# EAGLE design porcupine5v1_3 (EAGLE 6.5.0)
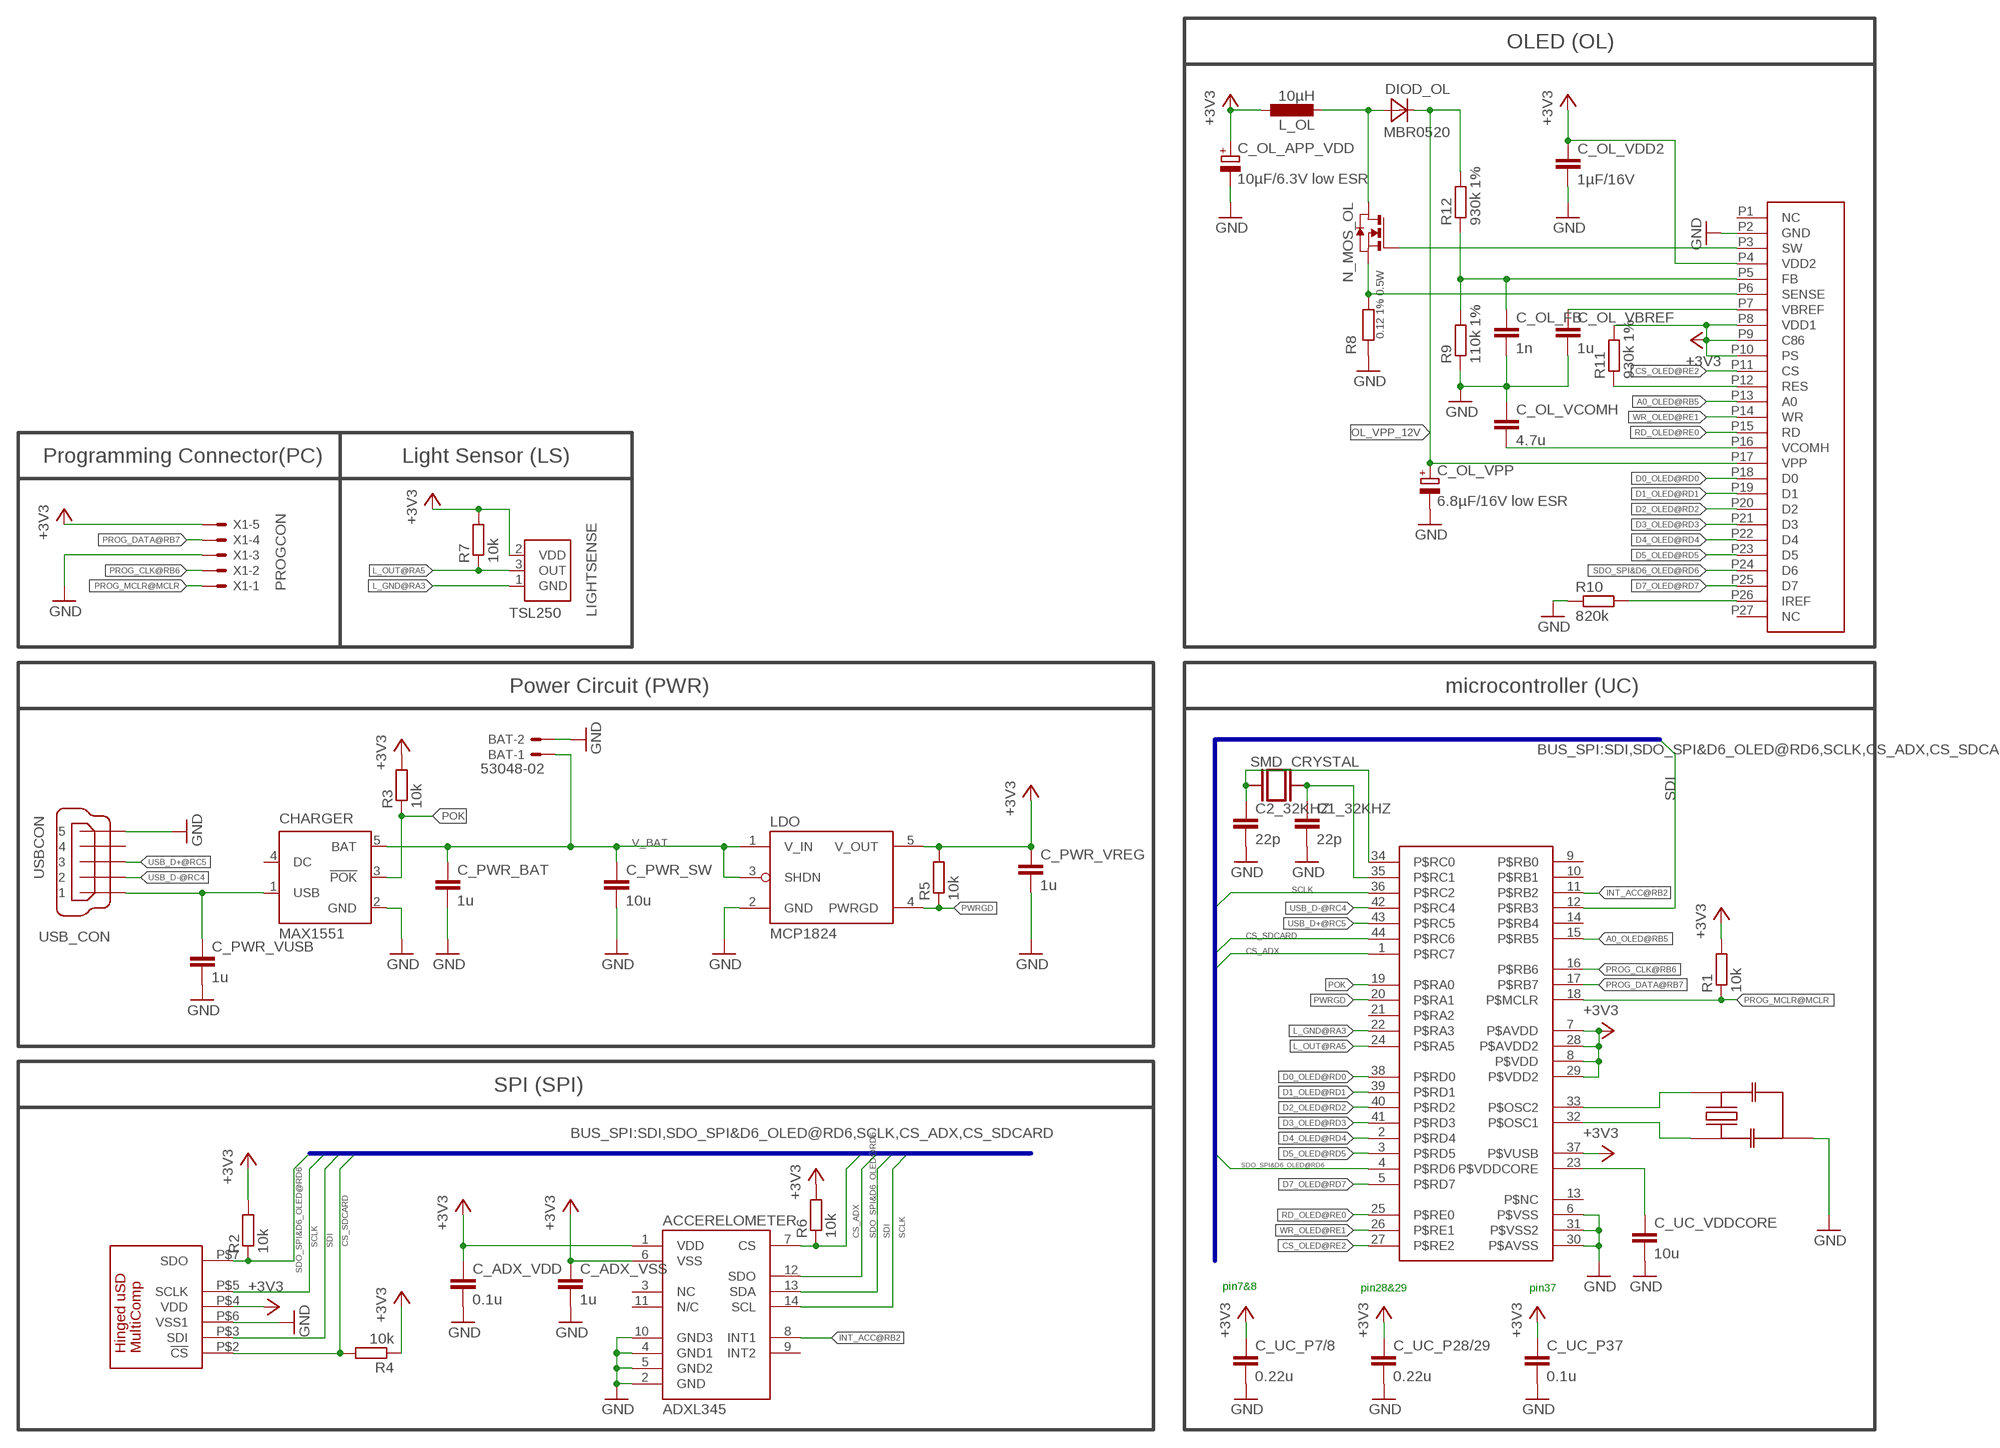
[diagram p0: schematic, sheet 1]

## Parts
ACCERELOMETER  ADXL345  [LGA14]
BAT  53048-02  [53048-02]
C1_32KHZ  22p  C-EUC0603K  [C0603K]
C2_32KHZ  22p  C-EUC0603K  [C0603K]
C_ADX_VDD  0.1u  C-EUC0603K  [C0603K]
C_ADX_VSS  1u  C-EUC0603K  [C0603K]
C_OL_APP_VDD  10µF/6.3V low ESR  CPOL-EUA/3216-18R  [A/3216-18R]
C_OL_FB  1n  C-EUC0603K  [C0603K]
C_OL_VBREF  1u  C-EUC0603K  [C0603K]
C_OL_VCOMH  4.7u  C-EUC0603K  [C0603K]
C_OL_VDD2  1µF/16V  C-EUC0603K  [C0603K]
C_OL_VPP  6.8µF/16V low ESR  CPOL-EUA/3216-18R  [A/3216-18R]
C_PWR_BAT  1u  C-EUC0603K  [C0603K]
C_PWR_SW  10u  C-EUC0805K  [C0805K]
C_PWR_VREG  1u  C-EUC0603K  [C0603K]
C_PWR_VUSB  1u  C-EUC0603K  [C0603K]
C_UC_P7/8  0.22u  C-EUC0603K  [C0603K]
C_UC_P28/29  0.22u  C-EUC0603K  [C0603K]
C_UC_P37  0.1u  C-EUC0603K  [C0603K]
C_UC_VDDCORE  10u  C-EUC0805K  [C0805K]
CHARGER  MAX1551  [SOT23-5L]
CON_OLED  OLED_DENSITRON  [CON_DD-12864WE-1A]
DIOD_OL  MBR0520  [SOD123]
L_OL  10µH  LQH3NP  [1212_FOR_INDUCTANCE]
LDO  MCP1824  [SOT-23-5]
LIGHTSENSE  TSL250  [TSL]
N_MOS_OL  MGSF1N02LT1  [SOT-23]
PIC_CONTROLLER  PIC_P2V6  [QFN44ML8X8]
R1  10k  R-EU_R0603  [R0603]
R2  10k  R-EU_R0603  [R0603]
R3  10k  R-EU_R0603  [R0603]
R4  10k  R-EU_R0603  [R0603]
R5  10k  R-EU_R0603  [R0603]
R6  10k  R-EU_R0603  [R0603]
R7  10k  R-EU_R0603  [R0603]
R8  0.12 1% 0.5W  RESISTOR_PAN_ERJB3CFR12V  [0805_UPSIDEDOWN]
R9  110k 1%  R-EU_R0603  [R0603]
R10  820k  R-EU_R0603  [R0603]
R11  930k 1%  R-EU_R0603  [R0603]
R12  930k 1%  R-EU_R0603  [R0603]
RESONATOR  RESONATORPRQC-S  [PRQC]
SDCARD_CON  MICROSD_CONN  [460DA40013]
SMD_CRYSTAL  SMD_CRYSTAL  [SMD_CRYSTAL]
USB_CON  USBCON  [248601]
X1  PROGCON  [53047-05-OCT]

## Nets
+3V3: ACCERELOMETER.1(VDD) ACCERELOMETER.6(VSS) C_ADX_VDD.1 C_ADX_VSS.1 C_OL_APP_VDD.+ C_OL_VDD2.2 C_PWR_VREG.1 C_UC_P7/8.1 C_UC_P28/29.1 C_UC_P37.1 CON_OLED.P4(VDD2) CON_OLED.P8(VDD1) CON_OLED.P9(C86) CON_OLED.P10(PS) L_OL.P$1 LDO.5(V_OUT) LIGHTSENSE.2(VDD) PIC_CONTROLLER.7(P$AVDD) PIC_CONTROLLER.8(P$VDD) PIC_CONTROLLER.28(P$AVDD2) PIC_CONTROLLER.29(P$VDD2) PIC_CONTROLLER.37(P$VUSB) R1.2 R2.2 R3.2 R4.1 R5.2 R6.2 R7.2 R11.2 SDCARD_CON.P$4(VDD) X1.5
A0_OLED@RB5: CON_OLED.P13(A0) PIC_CONTROLLER.15(P$RB5)
CS_ADX: ACCERELOMETER.7(CS) PIC_CONTROLLER.1(P$RC7) R6.1
CS_OLED@RE2: CON_OLED.P11(CS) PIC_CONTROLLER.27(P$RE2)
CS_SDCARD: PIC_CONTROLLER.44(P$RC6) R4.2 SDCARD_CON.P$2(!CS)
D0_OLED@RD0: CON_OLED.P18(D0) PIC_CONTROLLER.38(P$RD0)
D1_OLED@RD1: CON_OLED.P19(D1) PIC_CONTROLLER.39(P$RD1)
D2_OLED@RD2: CON_OLED.P20(D2) PIC_CONTROLLER.40(P$RD2)
D3_OLED@RD3: CON_OLED.P21(D3) PIC_CONTROLLER.41(P$RD3)
D4_OLED@RD4: CON_OLED.P22(D4) PIC_CONTROLLER.2(P$RD4)
D5_OLED@RD5: CON_OLED.P23(D5) PIC_CONTROLLER.3(P$RD5)
D7_OLED@RD7: CON_OLED.P25(D7) PIC_CONTROLLER.5(P$RD7)
GND: ACCERELOMETER.2(GND) ACCERELOMETER.4(GND1) ACCERELOMETER.5(GND2) ACCERELOMETER.10(GND3) BAT.2 C1_32KHZ.2 C2_32KHZ.2 C_ADX_VDD.2 C_ADX_VSS.2 C_OL_APP_VDD.- C_OL_FB.2 C_OL_VBREF.2 C_OL_VCOMH.1 C_OL_VDD2.1 C_OL_VPP.- C_PWR_BAT.2 C_PWR_SW.2 C_PWR_VREG.2 C_PWR_VUSB.2 C_UC_P7/8.2 C_UC_P28/29.2 C_UC_P37.2 C_UC_VDDCORE.2 CHARGER.2(GND) CON_OLED.P2(GND) LDO.2(GND) PIC_CONTROLLER.6(P$VSS) PIC_CONTROLLER.30(P$AVSS) PIC_CONTROLLER.31(P$VSS2) R8.P$2 R9.1 R10.1 RESONATOR.GND SDCARD_CON.P$6(VSS1) USB_CON.5 X1.3
INT_ACC@RB2: ACCERELOMETER.8(INT1) PIC_CONTROLLER.11(P$RB2)
L_GND@RA3: LIGHTSENSE.1(GND) PIC_CONTROLLER.22(P$RA3)
L_OUT@RA5: LIGHTSENSE.3(OUT) PIC_CONTROLLER.24(P$RA5) R7.1
N$1: PIC_CONTROLLER.33(P$OSC2) RESONATOR.1
N$2: PIC_CONTROLLER.32(P$OSC1) RESONATOR.2
N$3: C2_32KHZ.1 PIC_CONTROLLER.34(P$RC0) SMD_CRYSTAL.P$1
N$6: C1_32KHZ.1 PIC_CONTROLLER.35(P$RC1) SMD_CRYSTAL.P$2
N$10: DIOD_OL.A L_OL.P$2 N_MOS_OL.1(D)
OL_FB: C_OL_FB.1 CON_OLED.P5(FB) R9.2 R12.1
OL_IREF: CON_OLED.P26(IREF) R10.2
OL_SENSE: CON_OLED.P6(SENSE) N_MOS_OL.2(S) R8.P$3
OL_SW: CON_OLED.P3(SW) N_MOS_OL.3(G)
OL_VBREF: C_OL_VBREF.1 CON_OLED.P7(VBREF)
OL_VCOMH: C_OL_VCOMH.2 CON_OLED.P16(VCOMH)
OL_VPP_12V: C_OL_VPP.+ CON_OLED.P17(VPP) DIOD_OL.C R12.2
POK: CHARGER.3(!POK) PIC_CONTROLLER.19(P$RA0) R3.1
PROG_CLK@RB6: PIC_CONTROLLER.16(P$RB6) X1.2
PROG_DATA@RB7: PIC_CONTROLLER.17(P$RB7) X1.4
PROG_MCLR@MCLR: PIC_CONTROLLER.18(P$MCLR) R1.1 X1.1
PWRGD: LDO.4(PWRGD) PIC_CONTROLLER.20(P$RA1) R5.1
RD_OLED@RE0: CON_OLED.P15(RD) PIC_CONTROLLER.25(P$RE0)
RES_OLED: CON_OLED.P12(RES) R11.1
SCLK: ACCERELOMETER.14(SCL) PIC_CONTROLLER.36(P$RC2) SDCARD_CON.P$5(SCLK)
SDI: ACCERELOMETER.13(SDA) PIC_CONTROLLER.12(P$RB3) SDCARD_CON.P$3(SDI)
SDO_SPI&D6_OLED@RD6: ACCERELOMETER.12(SDO) CON_OLED.P24(D6) PIC_CONTROLLER.4(P$RD6) R2.1 SDCARD_CON.P$7(SDO)
USB_D+@RC5: PIC_CONTROLLER.43(P$RC5) USB_CON.3
USB_D-@RC4: PIC_CONTROLLER.42(P$RC4) USB_CON.2
V_BAT: BAT.1 C_PWR_BAT.1 C_PWR_SW.1 CHARGER.5(BAT) LDO.1(V_IN) LDO.3(SHDN)
VDDCORE: C_UC_VDDCORE.1 PIC_CONTROLLER.23(P$VDDCORE)
VUSB: C_PWR_VUSB.1 CHARGER.1(USB) USB_CON.1
WR_OLED@RE1: CON_OLED.P14(WR) PIC_CONTROLLER.26(P$RE1)
Unconnected: ACCERELOMETER.3(NC) ACCERELOMETER.9(INT2) ACCERELOMETER.11(N/C) CHARGER.4(DC) CON_OLED.P1(NC) CON_OLED.P27(NC) PIC_CONTROLLER.9(P$RB0) PIC_CONTROLLER.10(P$RB1) PIC_CONTROLLER.13(P$NC) PIC_CONTROLLER.14(P$RB4) PIC_CONTROLLER.21(P$RA2) USB_CON.4

## Buses
BUS_SPI:SDI,SDO_SPI&D6_OLED@RD6,SCLK,CS_ADX,CS_SDCARD

## Notes on the sheet
- OLED (OL)
- Programming Connector(PC) | Light Sensor (LS)
- Power Circuit (PWR) | microcontroller (UC)
- SPI (SPI)
- pin7&8 | pin28&29 | pin37

## Library data of the parts
ACCERELOMETER = HedgehogLib:ADXL345
BAT = con-molex:53?-02: CONNECTOR wire to board 1.25 mm (.049 inch) pitch header; MF: MOLEX; MPN: 53048-0210; OC_FARNELL: 1012259; OC_NEWARK: 57H4718
C1_32KHZ C2_32KHZ C_ADX_VDD C_ADX_VSS C_OL_FB C_OL_VBREF C_OL_VCOMH C_OL_VDD2 C_PWR_BAT C_PWR_SW C_PWR_VREG C_PWR_VUSB C_UC_P7/8 C_UC_P28/29 C_UC_P37 C_UC_VDDCORE = rcl:C-EU: CAPACITOR, European symbol
C_OL_APP_VDD C_OL_VPP = rcl:CPOL-EU: POLARIZED CAPACITOR, European symbol
CHARGER = maxim:MAX1551: Dual-Input USB/AC Adapter 1-Cell Li+ Battery Chargers Source: http://www.maxim-ic.com .. MAX1551-MAX1555.pdf
CON_OLED = HedgehogLib:OLED_DENSITRON
DIOD_OL = HedgehogLib:MBR0520
L_OL = HedgehogLib:LQH3NP
LDO = HedgehogLib:MCP1824: MCP1824T-3302E/OT http://de.farnell.com/1578387
LIGHTSENSE = HedgehogLib:TSL250
N_MOS_OL = HedgehogLib:MGSF1N02LT1: MOS FET
PIC_CONTROLLER = HedgehogLib:PIC_P2V6
R1-R7 R9-R12 = rcl:R-EU_: RESISTOR, European symbol
R8 = HedgehogLib:RESISTOR_PAN_ERJB3CFR12V
RESONATOR = jnode:RESONATOR: Ceramic Resonator with caps AWSCR-16.00CV-T: 16Mhz ceramic resonator with 22pF capacitors PRQC16.00SR5010X000: 16Mhz ceramic resonator with 10pF capacitors; DIGIKEY: http://search.digikey.com/scripts/DkSearch/dksus.dll?Detail&name=478-5420-1-ND
SDCARD_CON = HedgehogLib:MICROSD_CONN
SMD_CRYSTAL = HedgehogLib:SMD_CRYSTAL
USB_CON = HedgehogLib:USBCON: MINI USB 2.0 Connector TypeB
X1 = HedgehogLib:PROGCON: Programmer Connector wire to board 1.25 mm (.049 inch) pitch header

## Board
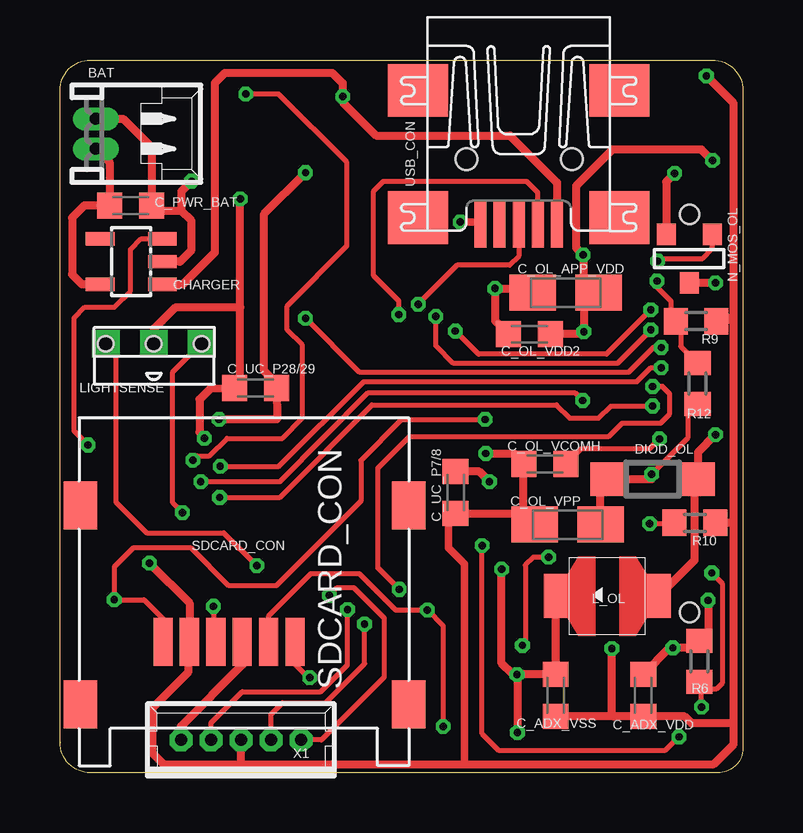
[diagram p1: board, top side]
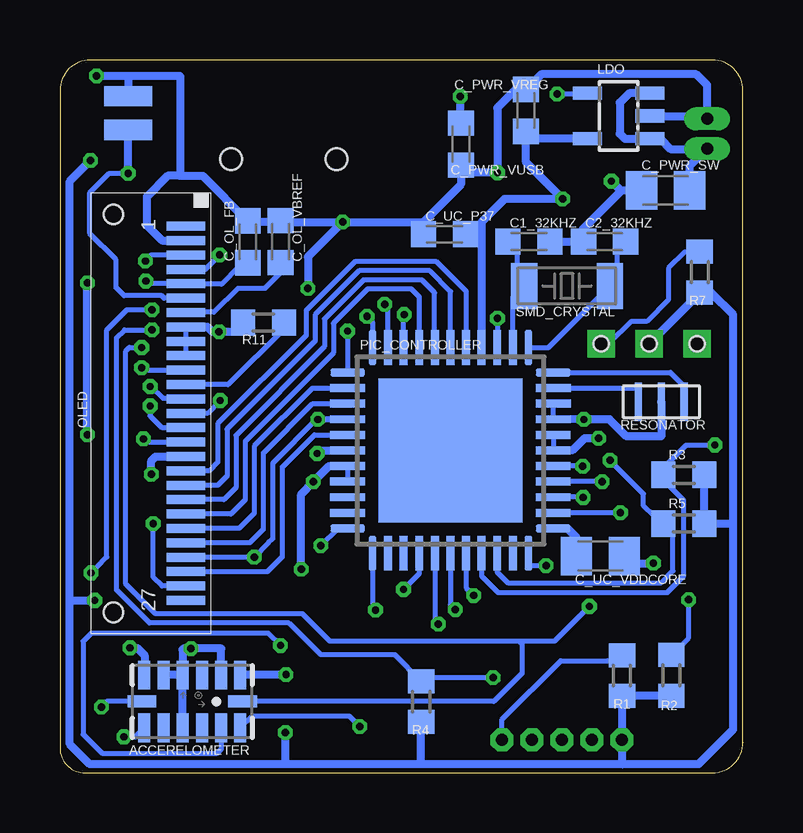
[diagram p2: board, bottom side, seen from below]

Size 28.47 x 29.72 mm. Coordinates in mm from the lower left corner, seen from the top.
Outline: 0,1.27 arc90 1.27,0 27.43,0 arc90 28.47,1.02 28.47,28.45 arc90 27.2,29.72 1.27,29.72 arc90 0,28.45 0,1.27
Outline: 0,1.27 0,1.25
Copper layers (1*16): Top 0.035mm / dielectric 1.5mm / Bottom 0.035mm
Design rules "default *": minimum track width 6mil, minimum drill 12mil, track to track 7mil, track to pad 7mil, pad to pad 7mil, via to via 7mil, smd to smd 7mil, copper to edge 6mil, drill to drill 6mil, minimum pad ring 9mil, minimum via ring 6mil, stop-mask expansion 6mil, vias tented up to drill 0mil, thermal gap 10mil

### Footprints (pad centres in the part's own frame; a part is rotated, then mirrored left to right if it is on the bottom)
LGA14 = smd 0.5 x 1.2: 1 2,1.1; 2 1.2,1.1; 3 0.4,1.1; 4 -0.4,1.1; 5 -1.2,1.1; 6 -2,1.1; 8 -2,-1.1; 9 -1.2,-1.1; 10 -0.4,-1.1; 11 0.4,-1.1; 12 1.2,-1.1; 13 2,-1.1 | smd 1.2 x 0.5: 7 -2.1,0; 14 2.1,0
53048-02 = drill 0.5 pad 0.698 long: 1 0.625,-1.25; 2 -0.625,-1.25
C0603K = smd 1.05 x 1.08: 1 -0.875,0; 2 0.875,0
A/3216-18R = smd 1.95 x 1.5: + 1.375,0; - -1.375,0
C0805K = smd 1.3 x 1.6: 1 -1,0; 2 1,0
SOT23-5L = smd 0.55 x 1.2: 1 -0.95,-1.3; 2 0,-1.3; 3 0.95,-1.3; 4 0.95,1.3; 5 -0.95,1.3
CON_DD-12864WE-1A = smd 0.375 x 1.6: P1 7.8,0; P2 7.2,0; P3 6.6,0; P4 6,0; P5 5.4,0; P6 4.8,0; P7 4.2,0; P8 3.6,0; P9 3,0; P10 2.4,0; P11 1.8,0; P12 1.2,0; P13 0.6,0; P14 0,0; P15 -0.6,0; P16 -1.2,0; P17 -1.8,0; P18 -2.4,0; P19 -3,0; P20 -3.6,0; P21 -4.2,0; P22 -4.8,0; P23 -5.4,0; P24 -6,0; P25 -6.6,0; P26 -7.2,0; P27 -7.8,0 | hole 0.8: -8.3,3.025; 8.3,3.025
SOD123 = smd 1.4 x 1.4: A 1.9,0; C -1.9,0
1212_FOR_INDUCTANCE = smd 1 x 1.8: P$1 -2.65,-1.65; P$2 1.65,-1.65
SOT-23-5 = smd 0.55 x 1.2: 1 -0.95,-1.3; 2 0,-1.3; 3 0.95,-1.3; 4 0.95,1.3; 5 -0.95,1.3
TSL = drill 0.635 pad 1.15 square: 1 -1.999,0; 2 0,0; 3 1.999,0 | hole 0.635: 0,0; -2,0; 2,0
SOT-23 = smd 0.787 x 0.889: 1 0.025,-1.016; 2 -0.94,1.016; 3 0.991,1.016
QFN44ML8X8 = smd 1.45 x 0.33: 1 -4.282,3.25; 2 -4.285,2.6; 3 -4.285,1.95; 4 -4.285,1.3; 5 -4.285,0.65; 6 -4.287,0; 7 -4.285,-0.649; 8 -4.287,-1.3; 9 -4.287,-1.949; 10 -4.285,-2.6; 11 -4.285,-3.25; 23 4.285,-3.25; 24 4.287,-2.6; 25 4.287,-1.95; 26 4.287,-1.3; 27 4.287,-0.652; 28 4.287,0; 29 4.287,0.65; 30 4.292,1.3; 31 4.293,1.953; 32 4.293,2.602; 33 4.285,3.25 | smd 0.33 x 1.45: 12 -3.25,-4.288; 13 -2.6,-4.287; 14 -1.949,-4.287; 15 -1.3,-4.287; 16 -0.65,-4.287; 17 0,-4.287; 18 0.65,-4.287; 19 1.3,-4.287; 20 1.95,-4.287; 21 2.6,-4.287; 22 3.25,-4.285; 34 3.25,4.288; 35 2.6,4.287; 36 1.95,4.287; 37 1.3,4.285; 38 0.65,4.287; 39 0,4.287; 40 -0.649,4.287; 41 -1.3,4.287; 42 -1.949,4.287; 43 -2.6,4.287; 44 -3.25,4.288 | smd 6 x 6: EXP 0,0
R0603 = smd 1 x 1.1: 1 -0.85,0; 2 0.85,0
0805_UPSIDEDOWN = smd 2 x 0.85: P$2 0,0.7; P$3 0,-0.7
PRQC = smd 0.3 x 1.6: 1 -0.95,0; 2 0.95,0; GND 0,0
460DA40013 = smd 2 x 0.8: P$2 9.35,-4.75; P$3 9.35,-5.85; P$4 9.35,-6.95; P$5 9.35,-8.05; P$6 9.35,-9.15; P$7 9.35,-10.25 | smd 2 x 1.4: P$9A 11.95,0; P$9B 3.65,0; P$10A 11.95,-13.7; P$10B 3.65,-13.7
SMD_CRYSTAL = smd 1.092 x 1.905: P$1 1.794,0; P$2 -1.778,0
248601 = smd 2 x 0.5: 1 2.25,1.6; 2 2.25,0.8; 3 2.25,0; 4 2.25,-0.8; 5 2.25,-1.6 | smd 2.2 x 2.5: M1 -3.3,-4.2; M2 -3.3,4.2; M3 2,4.2; M4 2,-4.2 | hole 0.9: -0.449,-2.177; -0.447,2.21
53047-05-OCT = drill 0.5 pad 0.889 octagon: 1 2.5,0; 2 1.25,0; 3 0,0; 4 -1.25,0; 5 -2.5,0

### Placement (x,y rotation side)
ACCERELOMETER  22.95,2.97 0 bottom
BAT  2.74,26.64 270 top
C1_32KHZ  8.92,22.15 0 bottom
C2_32KHZ  5.77,22.15 180 bottom
C_ADX_VDD  24.31,3.23 270 top
C_ADX_VSS  20.67,3.22 270 top
C_OL_APP_VDD  21.09,20.01 0 top
C_OL_FB  20.64,22.13 90 bottom
C_OL_VBREF  19.27,22.14 90 bottom
C_OL_VCOMH  20.22,12.87 0 top
C_OL_VDD2  19.58,18.28 0 top
C_OL_VPP  21.16,10.35 0 top
C_PWR_BAT  2.95,23.65 0 top
C_PWR_SW  3.23,24.28 180 bottom
C_PWR_VREG  9.04,27.61 90 bottom
C_PWR_VUSB  11.76,26.21 270 bottom
C_UC_P7/8  16.5,11.68 270 top
C_UC_P28/29  8.16,16.04 0 top
C_UC_P37  12.44,22.45 180 bottom
C_UC_VDDCORE  5.94,9.04 0 bottom
CHARGER  2.97,21.31 90 top
CON_OLED  23.22,14.99 90 bottom
DIOD_OL  24.71,12.24 0 top
L_OL  23.32,9.02 0 top
LDO  5.18,27.38 90 bottom
LIGHTSENSE  3.91,17.89 0 top
N_MOS_OL  26.21,21.44 0 top
PIC_CONTROLLER  12.19,13.44 0 bottom
R1  5.04,4.05 270 bottom
R2  2.98,4.06 270 bottom
R3  2.46,12.42 0 bottom
R4  13.41,2.97 90 bottom
R5  2.46,10.39 0 bottom
R6  26.66,4.64 90 top
R7  1.8,20.88 270 bottom
R8  25.63,27.51 0 bottom
R9  26.52,18.82 180 top
R10  26.47,10.42 180 top
R11  19.99,18.77 180 bottom
R12  26.58,16.23 270 top
RESONATOR  3.4,15.47 180 bottom
SDCARD_CON  14.55,14.8 270 top
SMD_CRYSTAL  7.34,20.29 0 bottom
USB_CON  19.13,25.14 270 top
X1  7.54,1.37 0 top

### Tracks (layer width: path | path; a pad name or v marks a point on that pad's centre or on a via)
+3V3  (via drill 0.3)
  Top 0.203: 21.84,19.86 21.99,20.01 C_OL_APP_VDD.+ 21.82,20.65 | R6.2 26.84,5.31
  Top 0.33: SDCARD_CON.P$4 7.59,4.96 7.59,4.5 5.04,1.95 X1.5 | v6.02,13.95 5.82,14.2 5.82,15.57 6.27,16.03 C_UC_P28/29.1 7.52,16.04 7.52,19.41 | 20.53,18.36 C_OL_VDD2.2 21.79,18.28 v21.84,18.39 21.84,19.86 | C_UC_P7/8.1 17.49,12.56 v17.91,12.14 | v25.55,5.21 v25.56,5.21 | v25.55,5.21 26.75,5.21 26.84,5.31 27.03,5.51 v27.03,7.19 | v25.55,5.21 25.57,5.19 | 21.82,20.65 v21.82,21.59 21.51,21.89 21.51,24.46 23.04,25.98 26.75,25.98 v27.2,25.53 | v18.41,8.48 18.41,4.57 18.87,4.12 v19.05,4.09 19.07,4.1 | C_ADX_VDD.1 25.4,5.21 v25.55,5.21 | L_OL.P$1 C_ADX_VSS.1 19.07,4.1 | 19.07,4.1 19.07,1.87 v19.07,1.68 | 7.52,19.41 v7.52,23.93 | LIGHTSENSE.2 3.91,18.49 4.27,18.85 4.83,19.41 7.52,19.41
  Bottom 0.203: PIC_CONTROLLER.8 | PIC_CONTROLLER.8 | PIC_CONTROLLER.37 10.87,17.75 10.9,17.77 | PIC_CONTROLLER.8 16.62,12.14 | 20.94,4.09 20.93,4.1 | PIC_CONTROLLER.29 PIC_CONTROLLER.28 | CON_OLED.P4 22.42,20.99 v21.82,21.59 | CON_OLED.P8 CON_OLED.P9 CON_OLED.P10 | PIC_CONTROLLER.7 PIC_CONTROLLER.8
  Bottom 0.33: v6.02,13.95 6.6,13.95 7.11,13.44 PIC_CONTROLLER.28 | 0.41,10.39 0.41,1.8 1.85,0.36 5,0.36 | 0.41,10.39 0.41,19.1 1.33,20.03 R7.2 1.88,19.92 LIGHTSENSE.2 | 24.96,4.06 ACCERELOMETER.6 24.94,4.09 24.94,4.9 25.25,5.21 v25.55,5.21 | v19.05,4.09 20.94,4.09 ACCERELOMETER.1 | v18.41,8.48 18.41,11.61 v17.91,12.14 17.26,12.79 PIC_CONTROLLER.7 | CON_OLED.P8 22.33,18.59 22.12,18.39 v21.84,18.39 21.27,18.39 R11.2 | 10.9,22.38 10.9,22.96 9.93,23.93 v7.52,23.93 9.04,25.45 C_PWR_VREG.1 8.69,26.43 LDO.5 | 10.9,22.38 10.9,17.77 | 5,0.36 13.41,0.36 | 13.41,0.36 19.07,0.36 | 19.07,0.36 27.23,0.36 28.07,1.19 28.07,7.19 | 28.07,7.19 v27.03,7.19 | 19.07,0.36 v19.07,1.68 | 28.07,7.19 28.07,24.66 v27.2,25.53 | 0.41,10.39 R5.2 R3.2 | 10.9,22.38 11.33,22.45 C_UC_P37.1 | 13.41,0.36 13.41,1.79 R4.1 | 5,0.36 arc90 5.04,0.4 X1.5 5.04,2.18 R1.2 4.97,3.2 R2.2
A0_OLED@RB5  (via drill 0.3)
  Top 0.203: v24.71,16.1 25.12,16.1 25.43,15.8 25.43,14.96 25.04,14.58 23.44,14.58 22.89,14.02 14.58,14.02 13.26,12.7 13.26,8.53 v14.15,7.64
  Bottom 0.203: CON_OLED.P13 23.79,15.59 23.82,15.62 24.18,15.62 24.66,16.1 v24.71,16.1 | PIC_CONTROLLER.15 13.49,8.3 v14.15,7.64
CS_ADX  (via drill 0.3)
  Top 0.203: v24.64,19.3 22.78,17.45 17.45,17.45 v16.48,18.41 | v26.75,2.74 26.75,3.42 R6.1 26.67,3.5 27.38,3.5 27.64,3.76 27.64,7.87 v27.18,8.33
  Bottom 0.203: 25.08,2.95 ACCERELOMETER.7 26.52,2.97 v26.75,2.74 | v24.64,19.3 25.68,19.3 26.52,18.47 26.52,8.99 26.95,8.56 v27.18,8.33 | v16.48,18.41 PIC_CONTROLLER.1
CS_OLED@RE2  (via drill 0.3)
  Top 0.203: v6.68,12.78 9.12,12.78 12.68,16.31 24.05,16.31 24.64,16.89 v25.07,16.89
  Bottom 0.203: PIC_CONTROLLER.27 6.8,12.79 v6.68,12.78 | CON_OLED.P11 24.97,16.79 v25.07,16.89
CS_SDCARD  (via drill 0.3)
  Top 0.203: v15.67,19.02 15.67,17.8 16.41,17.07 23.24,17.07 v24.64,18.47 | SDCARD_CON.P$2 9.8,4.53 10.36,3.96 v10.41,3.96
  Bottom 0.203: PIC_CONTROLLER.44 15.44,18.8 v15.67,19.02 | v24.64,18.47 25.78,18.47 26.11,18.14 26.11,7.62 24.74,6.25 18.92,6.25 17.6,4.93 14.52,4.93 R4.2 13.27,3.96 v10.41,3.96
D0_OLED@RD0
  Bottom 0.203: CON_OLED.P18 22.26,12.59 21.89,12.95 21.89,14.55 18.21,18.24 18.21,19.28 16.18,21.31 12.78,21.31 11.53,20.07 PIC_CONTROLLER.38
D1_OLED@RD1
  Bottom 0.203: CON_OLED.P19 21.89,11.99 21.51,12.37 21.51,14.33 17.83,18.01 17.83,19.1 16,20.93 13.06,20.93 12.19,20.07 PIC_CONTROLLER.39
D2_OLED@RD2
  Bottom 0.203: CON_OLED.P20 21.63,11.39 21.13,11.89 21.13,14.07 17.45,17.78 17.45,18.92 15.82,20.55 13.39,20.55 12.85,20.02 12.85,17.73 PIC_CONTROLLER.40
D3_OLED@RD3
  Bottom 0.203: PIC_CONTROLLER.41 13.49,19.84 13.82,20.17 15.65,20.17 17.07,18.75 17.07,17.5 20.75,13.82 20.75,11.38 21.34,10.79 CON_OLED.P21
D4_OLED@RD4
  Bottom 0.203: PIC_CONTROLLER.2 16.49,16.03 17.96,16.03 20.37,13.61 20.37,10.82 21,10.19 CON_OLED.P22
D5_OLED@RD5
  Bottom 0.203: CON_OLED.P23 20.56,9.59 19.99,10.16 19.99,13.34 17.93,15.39 PIC_CONTROLLER.3
D7_OLED@RD7
  Bottom 0.203: PIC_CONTROLLER.5 17.86,14.09 19.2,12.75 19.2,9.02 19.84,8.38 CON_OLED.P25
GND  (via drill 0.3)
  Top 0.203: C_OL_VCOMH.1 19.35,12.94 19,13.28
  Top 0.305: 16.87,0.36 16.87,8.71 16.2,9.37 16.2,10.52 C_UC_P7/8.2
  Top 0.33: USB_CON.5 17.42,22.97 v16.69,22.96 | v6.63,14.73 9.04,14.73 C_UC_P28/29.2 9.04,16.02 9.04,16.23 8.52,16.75 8.52,23.3 v10.24,25.02 | 19.33,10.81 C_OL_VPP.- | C_UC_P7/8.2 19.33,10.81 | C_OL_VCOMH.1 19.33,12.85 19.33,10.81 | C_OL_VPP.- 19.79,10.09 | C_OL_VPP.- 19.64,10.35 | C_OL_VDD2.1 18.14,18.85 v18.14,20.19 19.53,20.19 C_OL_APP_VDD.- | 27.47,18.92 R9.1 | 27.34,10.44 R10.1 28.09,10.42 28.09,10.41 | v17.75,13.31 17.78,13.28 19,13.28 | 7.54,0.36 16.87,0.36 27.25,0.36 28.09,1.19 28.09,2.06 | 7.54,0.36 X1.3 | 28.09,2.06 28.09,10.41 | 28.09,10.41 28.09,19.05 | 28.09,19.05 28.04,18.92 | 7.54,0.36 4.32,0.36 3.86,0.81 3.86,2.72 5.36,4.22 5.36,4.93 SDCARD_CON.P$6 5.4,7.07 v3.73,8.74 | 28.09,19.05 28.09,27.91 v26.95,29.06 | 23.08,2.35 21.66,2.35 C_ADX_VSS.2 | 23.08,2.35 C_ADX_VDD.2 26.04,2.35 26.34,2.06 28.09,2.06 | 23.08,2.35 23.01,2.42 v23.01,5.18 | CHARGER.2 5,21.31 5.49,21.79 5.49,23.01 5.05,23.44 | 5.05,23.44 4.03,23.44 C_PWR_BAT.2 3.82,26.07 2.63,27.27 BAT.2 | v5.49,24.66 5.05,24.23 5.05,23.44
  Top 0.406: 28.04,18.92 27.47,18.92
  Bottom 0.203: PIC_CONTROLLER.6 | PIC_CONTROLLER.30 PIC_CONTROLLER.31
  Bottom 0.33: ACCERELOMETER.4 ACCERELOMETER.5 | PIC_CONTROLLER.6 17.63,13.44 v17.75,13.31 | ACCERELOMETER.4 23.37,4.09 23.37,5.13 23.32,5.18 v23.01,5.18 21.75,5.18 ACCERELOMETER.2 | v16.69,22.96 18.82,22.96 C_OL_VBREF.2 19.32,23.01 19.46,22.99 20.62,22.99 C_OL_FB.2 22.52,24.89 23.47,24.89 | v16.69,22.96 18.14,21.51 v18.14,20.19 | PIC_CONTROLLER.30 v6.63,14.73 5.56,14.73 4.85,14.02 3.4,14.02 RESONATOR.GND | 23.47,24.89 23.98,24.89 24.84,24.03 24.84,22.81 24.22,22.19 CON_OLED.P2 | v26.95,29.06 25.6,29.06 | 25.6,29.06 23.47,29.06 23.47,24.89 | R8.P$2 25.63,29.03 25.6,29.06 | C1_32KHZ.2 C2_32KHZ.2 6.69,22.64 5.05,24.28 | LDO.2 1.63,27.38 BAT.2 1.49,28.67 1.94,29.12 8.41,29.12 C_PWR_VREG.2 9.47,28.48 10.24,27.72 v10.24,25.02 11.44,25.02 C_PWR_VUSB.2 11.76,24.52 13.32,22.96 | 5.05,24.28 C_PWR_SW.2 | v5.49,24.66 5.11,24.28 5.05,24.28 | C_UC_VDDCORE.2 4.7,8.73 v3.73,8.74 | ACCERELOMETER.10 ACCERELOMETER.4 | v16.69,22.96 13.32,22.96 | 13.32,22.96 C_UC_P37.2
INT_ACC@RB2  (via drill 0.3)
  Top 0.203: v25.81,1.5 25.25,0.94 18.29,0.94 17.6,1.63 v17.6,9.47
  Bottom 0.203: ACCERELOMETER.8 25.33,1.5 v25.81,1.5 | v17.6,9.47 16.89,10.19 PIC_CONTROLLER.11
L_GND@RA3  (via drill 0.3)
  Top 0.203: 8.2,8.66 v8.2,8.64 6.83,10.01 3.61,10.01 2.34,11.28 2.34,17.45 LIGHTSENSE.1
  Bottom 0.203: PIC_CONTROLLER.22 8.95,8.64 v8.2,8.64
L_OUT@RA5  (via drill 0.3)
  Top 0.203: v5.11,10.85 4.7,11.25 4.7,16.71 5.88,17.9 LIGHTSENSE.3
  Bottom 0.203: v5.11,10.85 5.12,10.84 PIC_CONTROLLER.24 | R7.1 2.41,21.72 3.1,21.03 3.1,19.74 4.01,18.82 4.65,18.82 5.56,17.91 LIGHTSENSE.3
N$1
  Bottom 0.203: PIC_CONTROLLER.33 3.02,16.69 2.45,16.12 RESONATOR.1
N$2
  Bottom 0.203: PIC_CONTROLLER.32 4.35,16.04 RESONATOR.2
N$3
  Bottom 0.203: PIC_CONTROLLER.34 8.11,17.73 SMD_CRYSTAL.P$1 5.23,20.3 5.23,21.64 C2_32KHZ.1
  Bottom 0.33: 5.61,20.3 SMD_CRYSTAL.P$1
N$6
  Bottom 0.203: PIC_CONTROLLER.35 9.6,19.82 SMD_CRYSTAL.P$2 9.4,20.3 9.4,22.15 C1_32KHZ.1
N$10  (via drill 0.3)
  Top 0.33: v27.33,14.1 26.61,13.37 DIOD_OL.A 26.61,11.87 26.47,11.73 26.47,8.87 L_OL.P$2 | v27.33,20.42 N_MOS_OL.1
  Bottom 0.33: v27.33,14.1 v27.33,20.42
OL_FB  (via drill 0.3)
  Top 0.203: v24.89,20.5 24.89,20.24 25.48,19.66 25.48,19.02 R9.2 25.88,18.82 25.88,17.77 R12.1
  Bottom 0.203: 23.74,20.39 23.77,20.42 23.93,20.42 23.95,20.4 24.79,20.4 v24.89,20.5 | CON_OLED.P5 23.21,20.37 21.74,20.37 21.02,21.1 20.9,21.36 C_OL_FB.1
  Bottom 0.33: CON_OLED.P5 23.74,20.39
OL_IREF  (via drill 0.3)
  Top 0.203: R10.2 25.59,10.39 v24.59,10.39
  Bottom 0.203: v24.59,10.39 24.59,8.15 24.22,7.79 CON_OLED.P26
OL_SENSE  (via drill 0.3)
  Top 0.33: N_MOS_OL.2 25.27,24.64 v25.63,24.99
  Bottom 0.203: CON_OLED.P6 24.13,19.79 24.23,19.89 25.81,19.89 26.14,20.22 26.14,21.39 27.23,22.48 27.23,24.18 26.42,24.99 v25.63,24.99
  Bottom 0.33: v25.63,24.99 R8.P$3
OL_SW  (via drill 0.3)
  Top 0.203: 27.2,22 N_MOS_OL.3 27.2,21.84 26.8,21.44 25.09,21.44 24.99,21.34 v24.92,21.34
  Bottom 0.203: CON_OLED.P3 24.66,21.59 v24.92,21.34
OL_VBREF
  Bottom 0.203: CON_OLED.P7 23.21,19.2 22.05,19.2 21.06,20.19 19.94,20.19 19.27,20.86 C_OL_VBREF.1
OL_VCOMH  (via drill 0.3)
  Top 0.203: v24.99,13.92 24.59,13.51 21.74,13.51 C_OL_VCOMH.2
  Bottom 0.203: v24.99,13.92 24.86,13.79 CON_OLED.P16
OL_VPP_12V  (via drill 0.3)
  Top 0.203: v24.66,12.45 26.2,13.98 26.2,15.38 R12.2
  Top 0.33: v24.66,12.45 24.66,12.24 DIOD_OL.C 22.54,11.98 C_OL_VPP.+
  Bottom 0.33: CON_OLED.P17 23.24,13.18 24.49,13.18 24.66,13.01 v24.66,12.45
POK  (via drill 0.3)
  Top 0.203: v1.17,13.66 0.58,14.25 0.58,18.95 1.04,19.41 2.26,19.41 2.95,20.09 2.95,21.82 3.39,22.26 CHARGER.3
  Bottom 0.203: v1.17,13.66 2.36,13.66 3.31,12.71 R3.1 3.31,12.2 2.46,11.35 2.46,8.2 3.15,7.52 10.21,7.52 10.89,8.2 PIC_CONTROLLER.19
PROG_CLK@RB6  (via drill 0.3)
  Top 0.203: v12.7,6.2 12.7,4.55 11.07,2.92 9.27,2.92 8.79,2.44 X1.2
  Bottom 0.203: PIC_CONTROLLER.16 12.85,6.34 v12.7,6.2
PROG_DATA@RB7  (via drill 0.3)
  Top 0.203: v11.99,6.81 11.99,4.5 10.87,3.38 7.59,3.38 6.29,2.08 X1.4
  Bottom 0.203: PIC_CONTROLLER.17 12.2,7.01 v11.99,6.81
PROG_MCLR@MCLR  (via drill 0.3)
  Top 0.203: v11.23,7.39 11.56,7.72 12.24,7.72 13.51,6.45 13.51,3.99 10.9,1.37 X1.1
  Bottom 0.203: X1.1 10.04,2.22 7.59,4.67 5.64,4.67 5.28,4.7 R1.1 | PIC_CONTROLLER.18 11.54,7.71 v11.23,7.39
PWRGD  (via drill 0.3)
  Top 0.203: v5.54,13.03 5.71,13.21 6.22,13.21 6.96,13.95 9.27,13.95 10.11,14.78 10.11,17.83 9.47,18.47 9.47,19.46 11.96,21.97 11.96,25.45 9.12,28.3 v7.75,28.3
  Bottom 0.203: v5.54,13.03 4.14,11.63 4.14,11.12 3.72,10.71 R5.1 2.92,10 2.92,8.41 3.4,7.92 9.8,7.92 10.24,8.37 PIC_CONTROLLER.20 | LDO.4 6.52,28.3 v7.75,28.3
RD_OLED@RE0  (via drill 0.3)
  Top 0.203: v6.66,11.48 9.17,11.48 13.01,15.34 20.7,15.34 21.26,14.78 22.45,14.78 22.96,15.29 v24.71,15.29
  Bottom 0.203: PIC_CONTROLLER.25 6.66,11.49 v6.66,11.48 | CON_OLED.P15 23.24,14.4 24.23,14.4 24.71,14.88 v24.71,15.29
RES_OLED
  Bottom 0.203: CON_OLED.P12 21.46,16.18 19.14,18.5 R11.1
SCLK  (via drill 0.3)
  Top 0.203: v10.24,18.95 12.5,16.69 23.7,16.69 24.74,17.73 v25.07,17.73 | SDCARD_CON.P$5 6.4,5.91 v6.4,6.93
  Bottom 0.203: v10.24,18.95 PIC_CONTROLLER.36 | 20.78,2.97 ACCERELOMETER.14 20.86,2.95 20.83,2.97 10.39,2.97 9.2,4.17 9.2,5.36 9.32,5.49 | 9.32,5.49 7.85,5.49 v6.4,6.93 | 9.32,5.49 17.22,5.49 18.36,6.63 24.49,6.63 25.73,7.87 25.73,17.58 25.58,17.73 v25.07,17.73
SDI  (via drill 0.3)
  Top 0.203: v15.98,1.93 15.98,6.12 v15.32,6.78 13.99,6.78 12.47,8.31 10.46,8.31 8.7,6.54 SDCARD_CON.P$3
  Bottom 0.203: ACCERELOMETER.13 20.93,1.85 | ACCERELOMETER.13 21.03,1.8 | ACCERELOMETER.13 20.47,2.36 16.41,2.36 v15.98,1.93 | PIC_CONTROLLER.12 15.45,6.91 v15.32,6.78
SDO_SPI&D6_OLED@RD6  (via drill 0.3)
  Top 0.203: v17.73,14.73 14.25,14.73 12.55,13.03 12.55,11.33 9.02,7.8 7.04,7.8 5.46,9.37 3.05,9.37 2.26,8.59 v2.26,7.21 3.5,7.21 4.31,6.41 SDCARD_CON.P$7 | v20.37,8.99 19.73,8.99 19.41,8.66 19.41,5.44 v19.28,5.31
  Bottom 0.203: CON_OLED.P24 v20.37,8.99 19.79,9.57 19.61,9.75 19.61,12.9 17.77,14.74 PIC_CONTROLLER.4 v17.73,14.73 | 21.77,1.86 ACCERELOMETER.12 21.74,0.99 21.92,0.81 26.72,0.81 27.51,1.6 27.51,5.49 27.18,5.82 19.79,5.82 v19.28,5.31 | R2.1 2.26,5.63 v2.26,7.21
USB_D+@RC5  (via drill 0.3)
  Top 0.178: 19.15,22.87 USB_CON.3
  Top 0.203: 19.15,22.87 19.15,21.57 18.75,21.16 16.56,21.16 v14.94,19.53
  Top 0.254: USB_CON.3
  Bottom 0.203: PIC_CONTROLLER.43 14.79,19.39 v14.94,19.53
USB_D-@RC4  (via drill 0.3)
  Top 0.178: 19.91,22.88 USB_CON.2 19.91,22.91
  Top 0.203: 19.91,22.91 19.91,24.21 19.46,24.66 13.49,24.66 13.08,24.26 13.08,20.73 14.12,19.68 v14.12,19.1
  Bottom 0.203: PIC_CONTROLLER.42 14.14,19.07 v14.12,19.1
V_BAT
  Top 0.33: CHARGER.5 0.93,20.36 0.51,20.78 0.51,23.14 1.02,23.65 C_PWR_BAT.1 2.07,25.47 BAT.1
  Bottom 0.33: LDO.3 4.74,28.33 5.13,27.94 5.13,26.64 4.92,26.43 LDO.1 3.44,26.43 3.02,26.01 1.53,26.01 BAT.1 2.23,25.29 C_PWR_SW.1
VDDCORE
  Bottom 0.33: PIC_CONTROLLER.23 7.32,10.19 6.94,9.81 C_UC_VDDCORE.1
VUSB  (via drill 0.3)
  Top 0.33: USB_CON.1 20.73,24.61 18.77,26.57 13.18,26.57 11.79,27.96 v11.79,28.19 11.79,28.75 11.35,29.18 6.88,29.18 6.46,28.76 6.46,21.7 5.12,20.36 CHARGER.1
  Bottom 0.33: C_PWR_VUSB.1 11.79,27.34 v11.79,28.19
WR_OLED@RE1  (via drill 0.3)
  Top 0.203: v5.87,12.14 9.17,12.14 12.85,15.85 21.46,15.85 v21.79,15.52
  Bottom 0.203: PIC_CONTROLLER.26 6.15,12.14 v5.87,12.14 | CON_OLED.P14 22.33,14.99 v21.79,15.52

### Text on the board
tNames: LIGHTSENSE | SDCARD_CON | L_OL
bNames: SMD_CRYSTAL | OLED | RESONATOR